# Altium schematic sheet BaseCircuit.SchDoc
size A; SheetNumber: 6; SheetTotal: 6
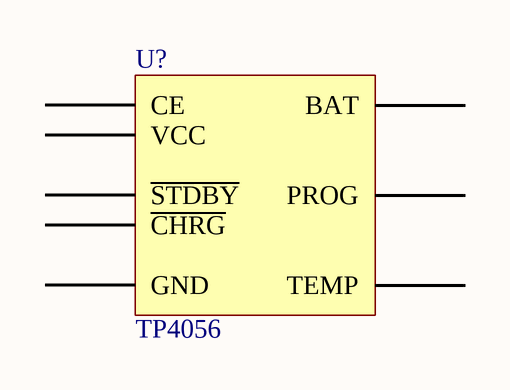
[diagram p0: BaseCircuit.SchDoc]

## Parts
U?  TP4056  [SOP_8]

## Nets

Not connected (* = marked no-connect by the designer): U? 1(TEMP) 2(PROG) 3(GND) 4(VCC) 5(BAT) 6(~{STDBY}) 7(~{CHRG}) 8(CE)

## Library data of the parts
U? = TP4056: Vcc=6V Ic=1A   ESOP-8 Battery Management ICs ROHS; Manufacturer: TPOWER; Manufacturer Part Number: TP4056; RoHS: No; Stock 1: 30410; Pricing 1: 5=0.12500, 50=0.10080, 150=0.08880, 500=0.07970, 2500=0.07250, 4000=0.06890 (USD); Supplier 1: LCSC; Supplier Part Number 1: C382139